# Altium schematic sheet ControlBoard.SchDoc
size 388 x 303 mm
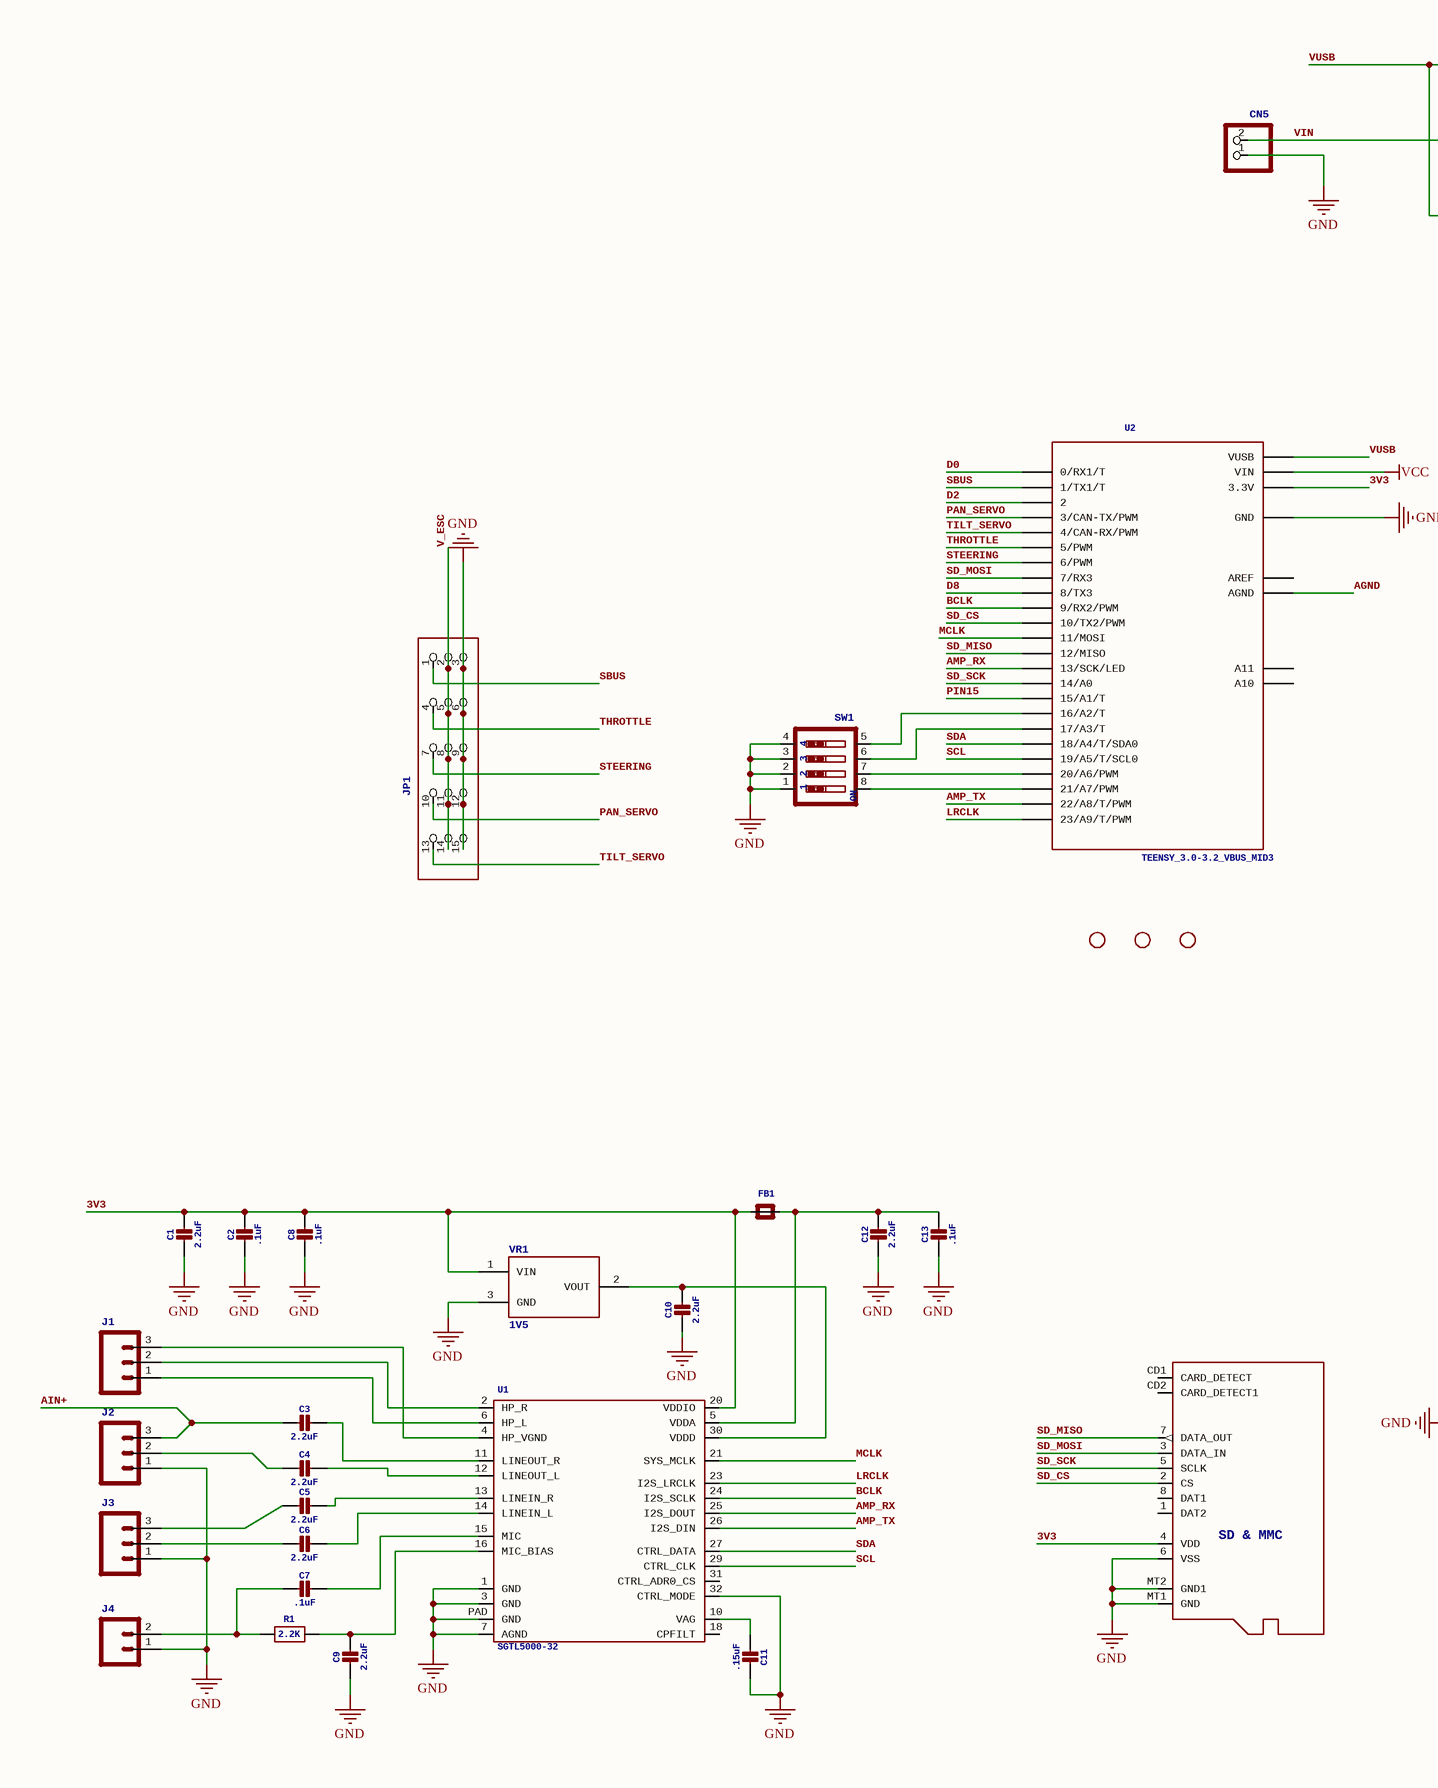
[diagram p0: ControlBoard.SchDoc, left]
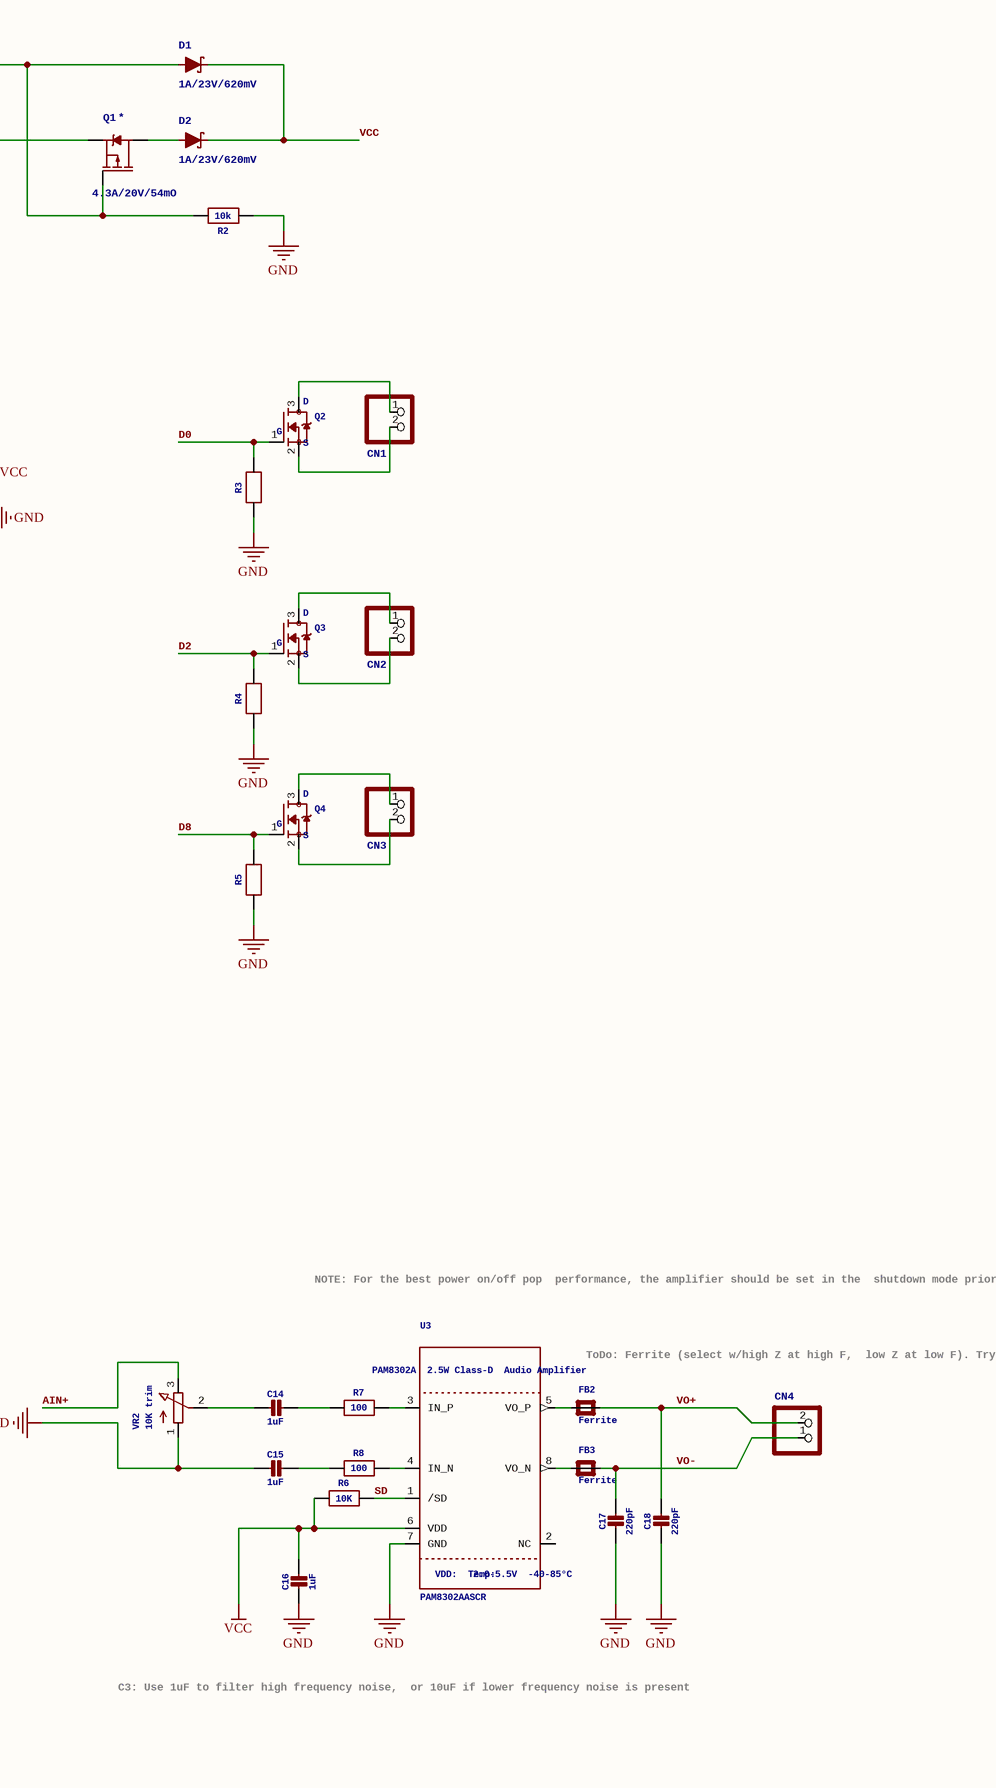
[diagram p1: ControlBoard.SchDoc, right]

## Parts
C1  2.2uF  [0805-NO]
C2  .1uF  [0805-NO]
C3  2.2uF  [_0603]
C4  2.2uF  [_0603]
C5  2.2uF  [_0603]
C6  2.2uF  [_0603]
C7  .1uF  [_0603]
C8  .1uF  [0805-NO]
C9  2.2uF  [_0603]
C10  2.2uF  [0805-NO]
C11  .15uF  [_0603]
C12  2.2uF  [0805-NO]
C13  .1uF  [0805-NO]
C14  1uF  [_0603]
C15  1uF  [_0603]
C16  1uF  [_0603]
C17  220pF  [_0603]
C18  220pF  [_0603]
CN1  JST_2PIN-SMT  [JST-PH-2-SMT]  (value not drawn)
CN2  JST_2PIN-SMT  [JST-PH-2-SMT]  (value not drawn)
CN3  JST_2PIN-SMT  [JST-PH-2-SMT]  (value not drawn)
CN4  JST_2PIN-SMT  [JST-PH-2-SMT]  (value not drawn)
CN5  JST_2PIN-SMT-RA  [JST-PH-2-SMT-RA]  (value not drawn)
D1  1A/23V/620mV  [SOD-323]
D2  1A/23V/620mV  [SOD-323]
FB1  FERRITE  [0603]  (value not drawn)
FB2  Ferrite  [0603]
FB3  Ferrite  [0603]
H1  STAND-OFF  [STAND-OFF]  (value not drawn)
H2  STAND-OFF  [STAND-OFF]  (value not drawn)
H3  STAND-OFF  [STAND-OFF]  (value not drawn)
J1  CONN_03  [1X03]  (value not drawn)
J2  CONN_03  [1X03]  (value not drawn)
J3  CONN_03  [1X03]  (value not drawn)
J4  CONN_02  [1X02]  (value not drawn)
JP1  PINHD-3X5/90  [3X05/90]  (value not drawn)
Q1  4.3A/20V/54mO  [SOT23-3]
Q2  MOSFET-NREFLOW  [SOT23]  (value not drawn)
Q3  MOSFET-NREFLOW  [SOT23]  (value not drawn)
Q4  MOSFET-NREFLOW  [SOT23]  (value not drawn)
R1  2.2K  [0805-NO]
R2  10k  [0603-MINI]
R3  RESISTOR0603MINI  [0603-MINI]  (value not drawn)
R4  RESISTOR0603MINI  [0603-MINI]  (value not drawn)
R5  RESISTOR0603MINI  [0603-MINI]  (value not drawn)
R6  10K  [0603-MINI]
R7  100  [0603-MINI]
R8  100  [0603-MINI]
SD1  SD&MMC: SD & MMC  [MICROSD]  (hidden comment: MICROSD)
SW1  SW_DIP-4  [EDG-04]  (value not drawn)
U1  SGTL5000-32  [QFN-32-5MM]
U2  TEENSY_3.0-3.2_VBUS_MID3  [TEENSY_3.0-3.2_VBUS_MID3]
U3  PAM8302AASCR  PAM8302A
2.5WClass-D
AudioAmplifier: PAM8302A / 2.5W Class-D / Audio Amplifier  VDD:
Temp: VDD: / Temp:  2.0-5.5V
-40-85°C: 2.0-5.5V / -40-85°C  [MSOP8_0.65MM]
VR1  1V5  [SOT23]
VR2  10K trim  [TRIMPOT_BOURNS_3303W]

## Nets
GND: C1.1 C2.1 C8.1 C9.1 C10.1 C11.2 C12.1 C13.1 C15.2 C16.2 C17.2 C18.2 CN5.1 J2.1 J3.1 J4.1 JP1.3 JP1.6 JP1.9 JP1.12 JP1.15 R2.1 R3.1 R4.1 R5.1 SD1.6(VSS) SD1.MT1(GND) SD1.MT2(GND1) SW1.1 SW1.2 SW1.3 SW1.4 U1.1(GND) U1.3(GND) U1.7(AGND) U1.32(CTRL_MODE) U1.PAD(GND) U2.GND U3.7(GND) VR1.3(GND) VR2.1(A)
VCC: C16.1 D1.C D2.C R6.1 U2.VIN U3.6(VDD)
3V3: C1.2 C2.2 C8.2 FB1.1(P$1) SD1.4(VDD) U1.20(VDDIO) U2.3.3V VR1.1(VIN)
AGND: U2.AGND
AIN+: C3.1 J2.3 VR2.3(E)
AMP_RX: U1.25(I2S_DOUT) U2.13(13/SCK/LED)
AMP_TX: U1.26(I2S_DIN) U2.22/A8(22/A8/T/PWM)
BCLK: U1.24(I2S_SCLK) U2.9(9/RX2/PWM)
D0: Q2.1(G) R3.2 U2.0(0/RX1/T)
D2: Q3.1(G) R4.2 U2.2
D8: Q4.1(G) R5.2 U2.8(8/TX3)
LRCLK: U1.23(I2S_LRCLK) U2.23/A9(23/A9/T/PWM)
MCLK: U1.21(SYS_MCLK) U2.11(11/MOSI)
PAN_SERVO: JP1.10 U2.3(3/CAN-TX/PWM)
PIN15: U2.15/A1(15/A1/T)
SBUS: JP1.1 U2.1(1/TX1/T)
SCL: U1.29(CTRL_CLK) U2.19/A5(19/A5/T/SCL0)
SD: R6.2 U3.1(/SD)
SD_CS: SD1.2(CS) U2.10(10/TX2/PWM)
SD_MISO: SD1.7(DATA_OUT) U2.12(12/MISO)
SD_MOSI: SD1.3(DATA_IN) U2.7(7/RX3)
SD_SCK: SD1.5(SCLK) U2.14/A0
SDA: U1.27(CTRL_DATA) U2.18/A4(18/A4/T/SDA0)
STEERING: JP1.7 U2.6(6/PWM)
THROTTLE: JP1.4 U2.5(5/PWM)
TILT_SERVO: JP1.13 U2.4(4/CAN-RX/PWM)
V_ESC: JP1.2 JP1.5 JP1.8 JP1.11 JP1.14
VIN: CN5.2 Q1.2(S)
VO+: C18.1 CN4.2 FB2.2(P$2)
VO-: C17.1 CN4.1 FB3.2(P$2)
VUSB: D1.A Q1.1(G) R2.2 U2.VUSB
NetC3_2: C3.2 U1.11(LINEOUT_R)
NetC4_1: C4.1 J2.2
NetC4_2: C4.2 U1.12(LINEOUT_L)
NetC5_1: C5.1 J3.3
NetC5_2: C5.2 U1.13(LINEIN_R)
NetC6_1: C6.1 J3.2
NetC6_2: C6.2 U1.14(LINEIN_L)
NetC7_1: C7.1 J4.2 R1.1
NetC7_2: C7.2 U1.15(MIC)
NetC9_2: C9.2 R1.2 U1.16(MIC_BIAS)
NetC10_2: C10.2 U1.30(VDDD) VR1.2(VOUT)
NetC11_1: C11.1 U1.10(VAG)
NetC12_2: C12.2 C13.2 FB1.2(P$2) U1.5(VDDA)
NetC14_1: C14.1 R7.1
NetC14_2: C14.2 VR2.2(S)
NetC15_1: C15.1 R8.1
NetCN1_1: CN1.1 Q2.3(D)
NetCN1_2: CN1.2 Q2.2(S)
NetCN2_1: CN2.1 Q3.3(D)
NetCN2_2: CN2.2 Q3.2(S)
NetCN3_1: CN3.1 Q4.3(D)
NetCN3_2: CN3.2 Q4.2(S)
NetD2_A: D2.A Q1.3(D)
NetFB2_1: FB2.1(P$1) U3.5(VO_P)
NetFB3_1: FB3.1(P$1) U3.8(VO_N)
NetJ1_1: J1.1 U1.6(HP_L)
NetJ1_2: J1.2 U1.2(HP_R)
NetJ1_3: J1.3 U1.4(HP_VGND)
NetR7_2: R7.2 U3.3(IN_P)
NetR8_2: R8.2 U3.4(IN_N)
NetSW1_5: SW1.5 U2.16/A2(16/A2/T)
NetSW1_6: SW1.6 U2.17/A3(17/A3/T)
NetSW1_7: SW1.7 U2.20/A6(20/A6/PWM)
NetSW1_8: SW1.8 U2.21/A7(21/A7/PWM)

Not connected (* = marked no-connect by the designer): SD1 1(DAT2) 8(DAT1) CD1(CARD_DETECT) CD2(CARD_DETECT1); U1 18(CPFILT) 31(CTRL_ADR0_CS); U2 A10 A11 AREF; U3 2(NC)

## Notes on the sheet
- NOTE: For the best power on/off pop
  performance, the amplifier should be set in the
  shutdown mode prior to power on/off operation
  (set SD low to power down the amp).
- ToDo: Ferrite (select w/high Z at high F,
  low Z at low F). Try to block everything
  >1MHz or so.
- C3: Use 1uF to filter high frequency noise,
  or 10uF if lower frequency noise is present

## Library data of the parts
C1 C2 C8 C10 C12 C13 = CAP_CERAMIC0805-NOOUTLINE: Ceramic Capacitors   For new designs, use the packages preceded by an '_' character since they are more reliable:   The following footprints should be used on most boards: _0402 - Standard footprint for regular board layouts  _0603 - Standard footprint for regular board layouts  _0805 - Standard footprint for regular board layouts  _1206 - Standard footprint for regular board layouts       For extremely tight-pitch boards where space is at a premium, the following 'micro-pitch' footprints can be used (smaller pads, no silkscreen outline, etc.): _0402MP - Micro-pitch footprint for very dense/compact boards  _0603MP - Micro-pitch footprint for very dense/compact boards  _0805MP - Micro-pitch footprint for very dense/compact boards  _1206MP - Micro-pitch footprint for very dense/compact boards; GateName_1: G$1; SymbolName_1: CAPACITOR; DeviceName: 0805-NOOUTLINE; LibraryName: ControlBoard; DeviceSetName: CAP_CERAMIC
C3-C7 C9 C11 C14-C18 = CAP_CERAMIC_0603: Ceramic Capacitors   For new designs, use the packages preceded by an '_' character since they are more reliable:   The following footprints should be used on most boards: _0402 - Standard footprint for regular board layouts  _0603 - Standard footprint for regular board layouts  _0805 - Standard footprint for regular board layouts  _1206 - Standard footprint for regular board layouts       For extremely tight-pitch boards where space is at a premium, the following 'micro-pitch' footprints can be used (smaller pads, no silkscreen outline, etc.): _0402MP - Micro-pitch footprint for very dense/compact boards  _0603MP - Micro-pitch footprint for very dense/compact boards  _0805MP - Micro-pitch footprint for very dense/compact boards  _1206MP - Micro-pitch footprint for very dense/compact boards; GateName_1: G$1; SymbolName_1: CAPACITOR; DeviceName: _0603; LibraryName: ControlBoard; DeviceSetName: CAP_CERAMIC
CN1-CN4 = JST_2PIN-SMT: JST 2-Pin Connectors of various flavors SMT-RA (S2B-PH-SM4) 4UConnector #17311  SMT  (B2B-PH-SM4)  THM-RA (S2B-PH)  THM  (B2B-PH); GateName_1: G$1; SymbolName_1: PINHD2; DeviceName: -SMT; LibraryName: adafruit; DeviceSetName: JST_2PIN
CN5 = JST_2PIN-SMT-RA: JST 2-Pin Connectors of various flavors SMT-RA (S2B-PH-SM4) 4UConnector #17311  SMT  (B2B-PH-SM4)  THM-RA (S2B-PH)  THM  (B2B-PH); GateName_1: G$1; SymbolName_1: PINHD2; DeviceName: -SMT-RA; LibraryName: ControlBoard; DeviceSetName: JST_2PIN
D1 D2 = DIODE-SCHOTTKY-BAT20J: Schottky diode    A Schottky diode is a semiconductor diode which has a low forward voltage drop and a very fast switching action.; GateName_1: G$1; PROD_ID: DIO-11623; SymbolName_1: DIODE-SCHOTTKY; DeviceName: -BAT20J; LibraryName: ControlBoard; DeviceSetName: DIODE-SCHOTTKY
FB1-FB3 = FERRITE: Ferrite Bead   0603 MMZ1608B121C - 120 Ohm @ 100MHz, 600mA, 0.15 Ohm DC Resistance - Digikey: 445-2164-1-ND  BK1608HW121-T - 120 Ohm, 600mA Ferrite Chip - Digikey: 587-1876-2-ND       0805 HZ0805B272R-10 - 2.7K Ohm @ 100MHz, 200mA, 0.8 Ohm DC Resistance - Digikey: 240-2504-1-ND (see also Murata BLM21BD272SN1L)  MMZ2012Y152B - 1.5K Ohm @ 100MHz, 500mA, 0.4 Ohm DC Resistance - Digikey: 445-1560-1-ND - Mainly for high frequency (80-400MHz)  MMZ2012R102A - 1K Ohm @ 100MHz, 500mA, 0.3 Ohm DC Resistance - Digikey: 445-1555-2-ND - More general purpose (10-200MHz); GateName_1: G$1; SymbolName_1: FERRITE; LibraryName: ControlBoard; DeviceSetName: FERRITE
H1-H3 = STAND-OFF: Stand Off    Drill holes for mechanically mounting via screws, standoffs, etc.   Note: Use the keepout ring to avoid running the screw head into surrounding components.  Variant Overviews  STAND-OFF - Mechanical footprint for a #4 phillips button head screw.  STAND-OFF-TIGHT - Mechanical footprint for a #4 phillips button head screw,      Example SparkFun Products  Screw - Phillips Head (1/4", 4-40, 10 pack) (PRT-10453)  Screw - Phillips Head (1/2", 4-40, 10 pack) (PRT-10452)  Screw - Phillips Head (3/4", 4-40, 10 pack) (PRT-10451)  Screw - Phillips Head (1", 4-40, 10 pack) (PRT-10450); GateName_1: G$1; SymbolName_1: STAND-OFF; LibraryName: SparkFun-Hardware; DeviceSetName: STAND-OFF
J1-J3 = CONN_03: Multi connection point. Often used as Generic Header-pin footprint for 0.1 inch spaced/style header connections    On any of the 0.1 inch spaced packages, you can populate with these:  Break Away Headers - Straight (PRT-00116)   Break Away Male Headers - Right Angle (PRT-00553)   Female Headers (PRT-00115)   Break Away Headers - Machine Pin (PRT-00117)   Break Away Female Headers - Swiss Machine Pin (PRT-00743)   Stackable Header - 3 Pin (Female, 0.1") (PRT-13875)        For SCREWTERMINALS and SPRING TERMINALS visit here:  Screw Terimnals on SparkFun.com (5mm/3.5mm/2.54mm spacing)       This device is also useful as a general connection point to wire up your design to another part of your project. Our various solder wires solder well into these plated through hole pads.  Hook-Up Wire - Assortment (Stranded, 22 AWG) (PRT-11375)   Hook-Up Wire - Assortment (Solid Core, 22 AWG) (PRT-11367)   View the entire wire category on our website here          Special notes:         Molex polarized connector foot print use with SKU : PRT-08232 with associated crimp pins and housings.; GateName_1: J$1; SymbolName_1: CONN_03; LibraryName: SparkFun-Connectors; DeviceSetName: CONN_03
J4 = CONN_02: Multi connection point. Often used as Generic Header-pin footprint for 0.1 inch spaced/style header connections    On any of the 0.1 inch spaced packages, you can populate with these:  Break Away Headers - Straight (PRT-00116)   Break Away Male Headers - Right Angle (PRT-00553)   Female Headers (PRT-00115)   Break Away Headers - Machine Pin (PRT-00117)   Break Away Female Headers - Swiss Machine Pin (PRT-00743)        For SCREWTERMINALS and SPRING TERMINALS visit here:  Screw Terimnals on SparkFun.com (5mm/3.5mm/2.54mm spacing)       This device is also useful as a general connection point to wire up your design to another part of your project. Our various solder wires solder well into these plated through hole pads.  Hook-Up Wire - Assortment (Stranded, 22 AWG) (PRT-11375)   Hook-Up Wire - Assortment (Solid Core, 22 AWG) (PRT-11367)   View the entire wire category on our website here          Special notes: Molex polarized connector foot print use with: PRT-08233 with associated crimp pins and housings.  2.54_SCREWTERM for use with  PRT-10571.  3.5mm Screw Terminal footprints for  PRT-08084  5mm Screw Terminal footprints for use with PRT-08432; GateName_1: G$1; SymbolName_1: CONN_02; LibraryName: SparkFun-Connectors; DeviceSetName: CONN_02
JP1 = PINHD-3X5/90: PIN HEADER 3x5 pin header, used for RC servo hookups; GateName_1: A; SymbolName_1: PINH3X5; DeviceName: /90; LibraryName: ControlBoard; DeviceSetName: PINHD-3X5
Q1 = MOSFET_PCH-IRLML2244: P-channel MOSFETs    Voltage controlled devices that allow control of high current outputs.   SparkFun Products: SparkFun ESP32 Thing  SparkFun ESP8266 Thing; GateName_1: G$1; SymbolName_1: LABELED-PMOS; PROD_ID: TRANS-11153; DeviceName: -IRLML2244; LibraryName: ControlBoard; DeviceSetName: MOSFET_PCH; NAME: *
Q2-Q4 = MOSFET-NREFLOW: N-Channel Mosfet 2N7002E - 60V 260mA SOT23 [Digikey: 2N7002ET1GOSTR-ND] - REEL  BSH103 - 30V 850mA SOT23 [Digikey: 568-5013-1-ND]; GateName_1: G$1; DeviceName: REFLOW; SymbolName_1: MOSFET-N; LibraryName: ControlBoard; DeviceSetName: MOSFET-N; D: D; S: S; G: G
R1 = RESISTOR0805_NOOUTLINE: Resistors   For new designs, use the packages preceded by an '_' character since they are more reliable:   The following footprints should be used on most boards: _0402 - Standard footprint for regular board layouts  _0603 - Standard footprint for regular board layouts  _0805 - Standard footprint for regular board layouts  _1206 - Standard footprint for regular board layouts       For extremely tight-pitch boards where space is at a premium, the following 'micro-pitch' footprints can be used (smaller pads, no silkscreen outline, etc.): _0402MP - Micro-pitch footprint for very dense/compact boards  _0603MP - Micro-pitch footprint for very dense/compact boards  _0805MP - Micro-pitch footprint for very dense/compact boards  _1206MP - Micro-pitch footprint for very dense/compact boards; GateName_1: G$1; SymbolName_1: RESISTOR; DeviceName: 0805_NOOUTLINE; LibraryName: microbuilder; DeviceSetName: RESISTOR
R2-R8 = RESISTOR0603MINI: Resistors   For new designs, use the packages preceded by an '_' character since they are more reliable:   The following footprints should be used on most boards: _0402 - Standard footprint for regular board layouts  _0603 - Standard footprint for regular board layouts  _0805 - Standard footprint for regular board layouts  _1206 - Standard footprint for regular board layouts       For extremely tight-pitch boards where space is at a premium, the following 'micro-pitch' footprints can be used (smaller pads, no silkscreen outline, etc.): _0402MP - Micro-pitch footprint for very dense/compact boards  _0603MP - Micro-pitch footprint for very dense/compact boards  _0805MP - Micro-pitch footprint for very dense/compact boards  _1206MP - Micro-pitch footprint for very dense/compact boards; GateName_1: G$1; SymbolName_1: RESISTOR; DeviceName: 0603MINI; LibraryName: ControlBoard; DeviceSetName: RESISTOR
SD1 = MICROSD: Micro-SD / Transflash card holder with SPI pinout   For the 3M # 2908-05WB-MG and/or 4UCON #19656 push-push type; GateName_1: G$1; SymbolName_1: TRANSFLASH; LibraryName: ControlBoard; DeviceSetName: MICROSD
SW1 = SW_DIP-4: DIP SWITCH; GateName_1: A; SymbolName_1: SW_DIP-4; LibraryName: ControlBoard; DeviceSetName: SW_DIP-4; 1: 1; 2: 2; 3: 3; 4: 4; ON: ON
U1 = SGTL5000-32: GateName_1: G$1; SymbolName_1: SGTL5000-32; LibraryName: ControlBoard; DeviceSetName: SGTL5000-32
U2 = TEENSY_3.0-3.2_VBUS_MID3: GateName_1: A; SymbolName_1: TEENSY_3.0-3.2_VBUS_MID3; LibraryName: ControlBoard; DeviceSetName: TEENSY_3.0-3.2_VBUS_MID3
U3 = AUDIOAMP_PAM8302A: PAM8302A - 2.5W Class-D Mono Audio Amplifier    MSOP8 = PAM8302AASCR; GateName_1: G$1; SymbolName_1: PAM8302A; LibraryName: microbuilder; DeviceSetName: AUDIOAMP_PAM8302A
VR1 = AP7313SOT: Diodes Incorporated Low Dropout Linear Regulator  150mA at 1.0V to 3.3V, 2V to 6V input 150mV dropout at 150mA operation  TEMPERATURE: -40C to 85C    Datasheet Link; GateName_1: A; SymbolName_1: LDO; DeviceName: SOT; DeviceSetName: AP7313; LibraryName: ControlBoard
VR2 = TRIMPOT3303W/X: 3-Pin SMT Trimpots   Bourns TC33 (X-2) Series  1K - Digikey: TC33X-102ECT-ND   10K - Digikey: TC33X-2-103E   100K - Digikey: TC33X-104ECT-ND       Bourns 3303 (W) Series  3mm 10K Single Turn - Digikey: 3303W-103ETR-ND   3mm 100K Single Turn - Digikey: 3303X-104ETR-ND; GateName_1: G$1; SymbolName_1: POTENTIOMETER; DeviceName: 3303W/X; LibraryName: ControlBoard; DeviceSetName: TRIMPOT